# Altium schematic sheet MPPT_CC_CV_Charger_B.SchDoc
size A4; SheetNumber: 3; SheetTotal: 10
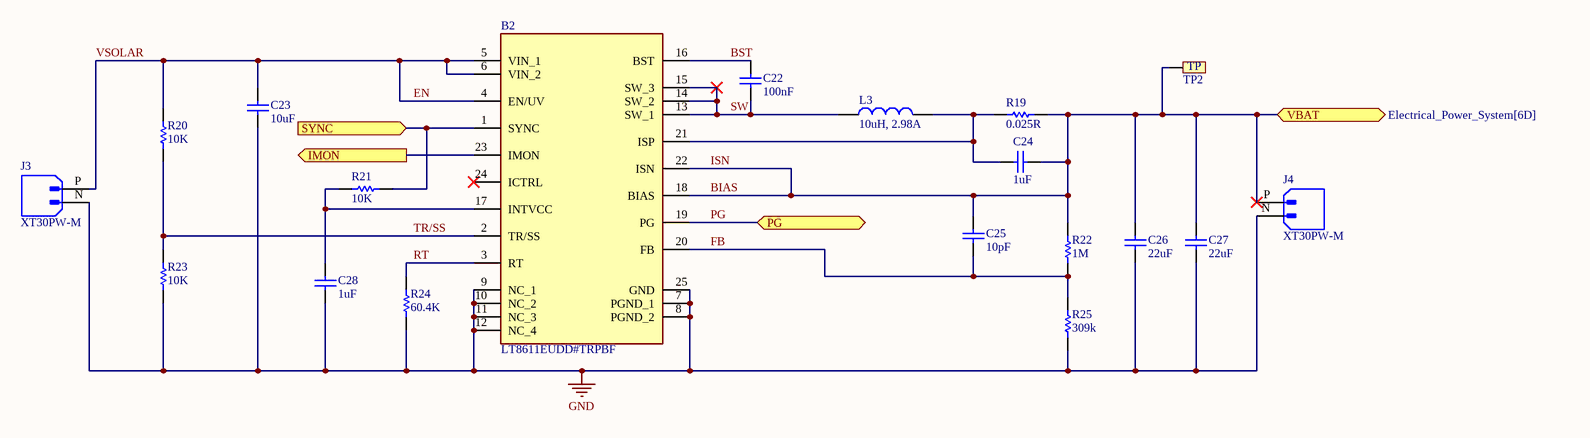
[diagram p0: MPPT_CC_CV_Charger_B.SchDoc]

## Parts
B2  LT8611EUDD#TRPBF  [QFN50P300X500X80-25N-D]
C22  value 100nF  [CAP-SM-0603]  (hidden comment: Cap Non-Pol SMD)
C23  value 10uF  [CAP-SM-0603]  (hidden comment: Cap Non-Pol SMD)
C24  value 1uF  [CAP-SM-0603]  (hidden comment: Cap Non-Pol SMD)
C25  value 10pF  [CAP-SM-0603]  (hidden comment: Cap Non-Pol SMD)
C26  value 22uF  [CAP-SM-0603]  (hidden comment: Cap Non-Pol SMD)
C27  value 22uF  [CAP-SM-0603]  (hidden comment: Cap Non-Pol SMD)
C28  value 1uF  [CAP-SM-0603]  (hidden comment: Cap Non-Pol SMD)
J3  XT30PW-M  [AMASS_XT30PW-M]
J4  XT30PW-M  [AMASS_XT30PW-M]
L3  10uH, 2.98A  [WE-PD2A_1054]
R19  value 0.025R  [RES-SM-0603]  (hidden comment: RESISTOR SMD)
R20  value 10K  [RES-SM-0603]  (hidden comment: RESISTOR SMD)
R21  value 10K  [RES-SM-0603]  (hidden comment: RESISTOR SMD)
R22  value 1M  [RES-SM-0603]  (hidden comment: RESISTOR SMD)
R23  value 10K  [RES-SM-0603]  (hidden comment: RESISTOR SMD)
R24  value 60.4K  [RES-SM-0603]  (hidden comment: RESISTOR SMD)
R25  value 309k  [RES-SM-0603]  (hidden comment: RESISTOR SMD)
TP2  Test Point  [TP]  (value not drawn)

## Ports
IMON (out, see Electrical_Power_System[7D]), PG (bidir, see Electrical_Power_System[7D]), SYNC (in, see Electrical_Power_System[7D], MPPT_CC_CV_Charger_A[1B]), VBAT (bidir, see Electrical_Power_System[6D])

## Nets
GND: B2.7(PGND_1) B2.8(PGND_2) B2.9(NC_1) B2.10(NC_2) B2.11(NC_3) B2.12(NC_4) B2.25(GND) C23.1 C26.1 C27.1 C28.1 J3.N J4.N R23.1 R24.1 R25.1
BIAS: B2.18(BIAS) B2.22(ISN) C24.1 C25.2 C26.2 C27.2 J4.P R19.1 R22.2 TP2.TP1 ; port VBAT  [also labelled ISN]
BST: B2.16(BST) C22.2
EN: B2.4(EN/UV) B2.5(VIN_1) B2.6(VIN_2) C23.2 J3.P R20.2  [also labelled VSOLAR]
FB: B2.20(FB) C25.1 R22.1 R25.2
IMON: B2.23(IMON) ; port IMON
PG: B2.19(PG) ; port PG
RT: B2.3(RT) R24.2
SW: B2.13(SW_1) B2.14(SW_2) B2.15(SW_3) C22.1 L3.1
SYNC: B2.1(SYNC) R21.1 ; port SYNC
TR/SS: B2.2(TR/SS) R20.1 R23.2
NetB2_17: B2.17(INTVCC) C28.2 R21.2
NetB2_21: B2.21(ISP) C24.2 L3.2 R19.2

Not connected (* = marked no-connect by the designer): B2 24(ICTRL)*

## Notes on the sheet
- (in symbol Test Point) TP

## Library data of the parts
B2 = LT8611EUDD#TRPBF: 42V, 2.5A Synchronous Step-Down Regulator with Current Sense and 2.5uA Quiescent Current; Manufacturer_Name: Analog Devices; Geometry.Height: 0.8mm; Mouser Part Number: 584-LT8611EUDD#TRPBF; Mouser Price/Stock: https://www.mouser.co.uk/ProductDetail/Analog-Devices/LT8611EUDDTRPBF?qs=hVkxg5c3xu8xYINPiSHe4g%3D%3D; Manufacturer_Part_Number: LT8611EUDD#TRPBF; Datasheet Link: https://www.analog.com/LT8611/datasheet
C22-C28 = Cap Non-Pol SMD: Capacitor
J3 J4 = XT30PW-M: Socket; DC supply; XT30; male; PIN: 2; on PCBs; THT; Colour: yellow; MF: AMASS; SnapEDA_Link: https://www.snapeda.com/parts/XT30PW-M/AMASS/view-part/?ref=snap; Package: None; Value: *; MP: XT30PW-M; Check_prices: https://www.snapeda.com/parts/XT30PW-M/AMASS/view-part/?ref=eda
L3 = 78477610: WE-PD2A SMT Power Inductor, size 1054, 10uH, 2.98A; Manufacturer: Wurth Elektronik; DC Resistance max.: 0.06Ohm; Saturation Current: 3.24A; Self Resonant Frequency: 27.52MHz; DC Resistance typ.: 0.028Ohm; Rated Voltage: 80VDC; ComponentLink1Description: Datasheet; ComponentLink1URL: https://www.we-online.com/catalog/datasheet/78477610.pdf; Manufacturer Part Number: 78477610; Published Date: May 2020; Rated Current: 2.98A; Inductance: 10uH; Operating Temperature: -40 to +125degC; Packaging: Tape and Reel; Size: 1054; Supplier 1 URL: https://www.digikey.com/en/products/detail/w%C3%BCrth-elektronik/78477610/5168783?s=N4IgjCBcoGwJxVAYygMwIYBsDOBTANCAPZQDaIALAAxwDMdIAuoQA4AuUIAymwE4CWAOwDmIAL6EwAJjgRoIFJAw4CxMiADsYMBQAcTVh0jc%2BQ0RJBSqujYgVoseQiUjkwVAAQBWgBIGQ7JwAqoL8bADyqACyuOjYAK68uOKEVrr68orKTmqulgB0cLoeAIL%2BgcYhYZExcYnJYo1AA; Supplier 1 URL: https://www.mouser.vn/ProductDetail/Wurth-Elektronik/78477610?qs=sBf%2Fb4nBSlfmBIqyB8oiaA%3D%3D; Supplier 3 URL: N/A; Value: 10uH, 2.98A; Supplier 2 URL: N/A; LCSC Part #: N/A; Mount: SMD/SMT; Supplier 1: Mouser; Supplier 1 Part Number: 710-78477610; Supplier 2: Digi-Key; Supplier 2 Part Number: 732-6881-2-ND; Supplier 3: thegioiic; Supplier 3 Part Number: N/A
R19-R25 = RESISTOR SMD: Resistor